# EAGLE design Isolator (EAGLE 6.4)
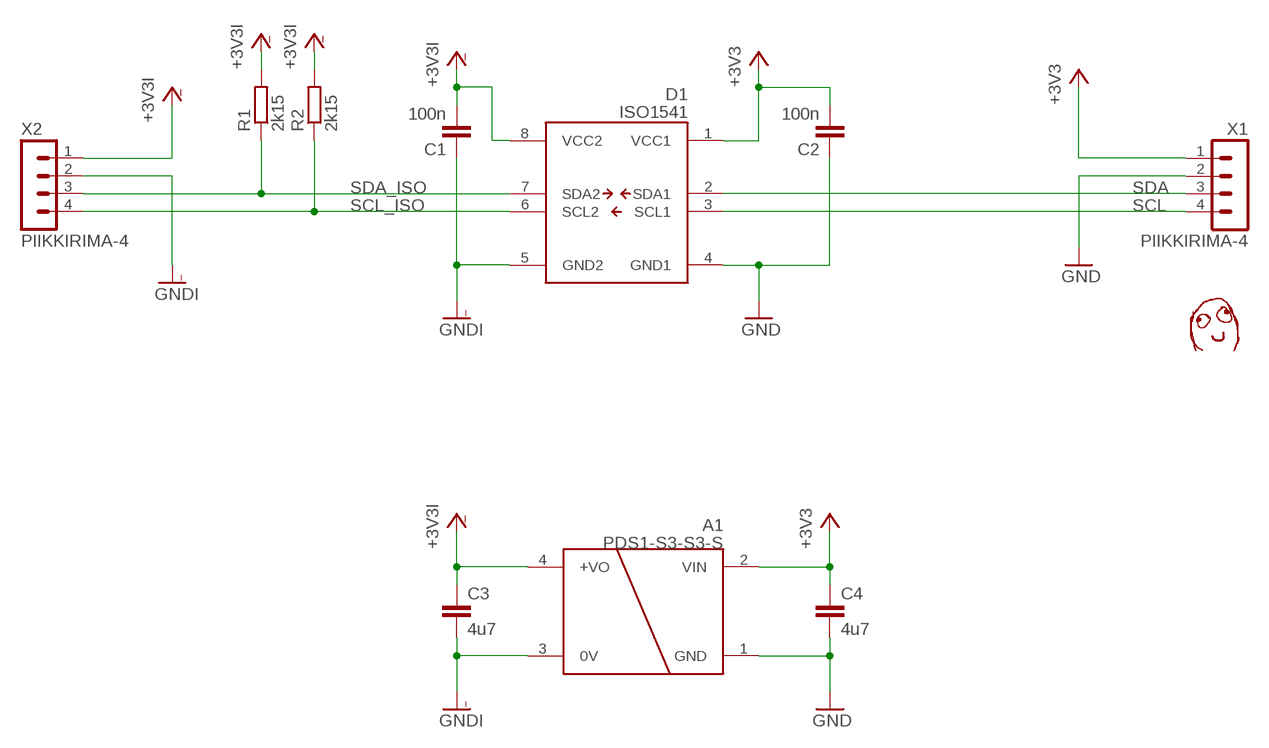
[diagram p0: schematic, sheet 1]

## Parts
A1  PDS1-S3-S3-S  [DCDC_SIP4]
C1  100n  C-EUC0603  [C0603]
C2  100n  C-EUC0603  [C0603]
C3  4u7  C-EUC0805  [C0805]
C4  4u7  C-EUC0805  [C0805]
D1  ISO1541  [SOIC8-N_MC]
R1  2k15  R-EU_R0603  [R0603]
R2  2k15  R-EU_R0603  [R0603]
U$1  DAFUG  [DAFUG]
X1  PIIKKIRIMA-4  [PIIKKIRIMA-4]
X2  PIIKKIRIMA-4  [PIIKKIRIMA-4]

## Nets
+3V3: A1.2(VIN) C2.2 C4.1 D1.1(VCC1) X1.1
+3V3I: A1.4(+VO) C1.2 C3.1 D1.8(VCC2) R1.2 R2.2 X2.1
GND: A1.1(GND) C2.1 C4.2 D1.4(GND1) X1.2
GNDI: A1.3(0V) C1.1 C3.2 D1.5(GND2) X2.2
SCL: D1.3(SCL1) X1.4
SCL_ISO: D1.6(SCL2) R2.1 X2.4
SDA: D1.2(SDA1) X1.3
SDA_ISO: D1.7(SDA2) R1.1 X2.3

## Library data of the parts
A1 = OMAT_IC:PDS1-
C1-C4 = rcl:C-EU: CAPACITOR, European symbol
D1 = OMAT_IC:ISO1541
R1 R2 = rcl:R-EU_: RESISTOR, European symbol
U$1 = dafug:DAFUG
X1 X2 = OMAT_IC:PIIKKIRIMA-4

## Board
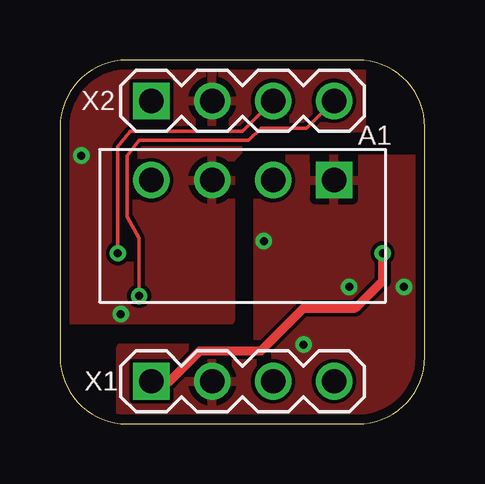
[diagram p1: board, top side]
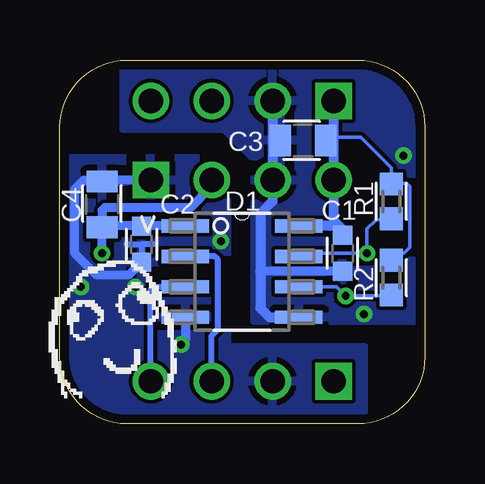
[diagram p2: board, bottom side, seen from below]

Size 15.22 x 15.16 mm. Coordinates in mm from the lower left corner, seen from the top.
Outline: 0,12.37 0,2.79 arc90 2.79,0 12.43,0 arc90 15.22,2.79 15.22,12.37 arc90 12.43,15.16 2.79,15.16 arc90 0,12.37
Copper layers (1*16): Top 0.0356mm / dielectric 1.5011mm / Bottom 0.0356mm
Design rules "LaenPCBOrder": minimum track width 6mil, minimum drill 13mil, track to track 6mil, track to pad 6mil, pad to pad 6mil, via to via 6mil, smd to smd 6mil, copper to edge 15mil, drill to drill 6mil, minimum pad ring 7mil, minimum via ring 7mil, stop-mask expansion 4mil, vias tented up to drill 0mil, thermal gap 10mil

### Footprints (pad centres in the part's own frame; a part is rotated, then mirrored left to right if it is on the bottom)
DCDC_SIP4 = drill 1.016 square: 1 0,0 | drill 1.016: 2 2.54,0; 3 5.08,0; 4 7.62,0
C0603 = smd 0.8 x 0.8: 1 -0.75,0; 2 0.75,0
C0805 = smd 0.9 x 1.3: 1 -0.95,0; 2 0.95,0
SOIC8-N_MC = smd 1.981 x 0.559: 1 -2.362,1.905; 2 -2.362,0.635; 3 -2.362,-0.635; 4 -2.362,-1.905; 5 2.362,-1.905; 6 2.362,-0.635; 7 2.362,0.635; 8 2.362,1.905
R0603 = smd 0.95 x 0.95: 1 -0.725,0; 2 0.725,0
PIIKKIRIMA-4 = drill 1.016 square: 1 0,0 | drill 1.016: 2 2.54,0; 3 5.08,0; 4 7.62,0

### Placement (x,y rotation side)
A1  11.43,10.16 180 top
C1  3.43,7.11 90 bottom
C2  11.81,7.49 90 bottom
C3  5.08,11.81 180 bottom
C4  13.46,9.14 90 bottom
D1  7.62,6.35 0 bottom
R1  1.4,9.27 90 bottom
R2  1.4,6.1 90 bottom
U$1  12.83,3.68 0 bottom
X1  3.81,1.78 0 top
X2  3.81,13.46 0 top

### Tracks (layer width: path | path; a pad name or v marks a point on that pad's centre or on a via)
+3V3  (via drill 0.33)
  Top 0.381: X1.1 4.57,1.78 5.84,3.05 8.38,3.05 10.16,4.83 12.32,4.83 13.46,5.97 v13.46,7.11
  Bottom 0.381: D1.1 11.8,8.25 C2.2 11.81,8.25 13.46,8.25 | A1.2 8.89,9.91 9.78,9.02 13.34,9.02 13.46,8.89 13.46,8.25 | 13.46,8.25 C4.1 v13.46,7.11
+3V3I
  Bottom 0.152: C3.1 4,11.94 2.67,11.94 1.4,10.67 R1.2 1.36,10.03 0.76,10.03 0.64,9.91 0.64,7.37 1.18,6.82 R2.2
  Bottom 0.381: C1.2 3.43,8.13 3.81,8.51
  Bottom 0.406: C3.1 3.81,11.81 | 3.81,11.81 A1.4 3.81,8.51 3.81,8.38 3.94,8.25 D1.8 | X2.1 3.81,11.81
GND  (via drill 0.33)
  Bottom 0.254: 11.3,7.49 11.81,7.49 | 12.45,7.49 11.81,7.49 | 11.81,7.49 11.81,6.99
  Bottom 0.381: A1.1 13.65,10.16 C4.2 13.53,10.16 14.22,10.16 14.61,9.78 14.61,7.11 13.72,6.22 12.33,6.22 C2.1 | D1.4 9.98,3.48 v10.16,3.3
  other vias: 12.06,5.71 14.35,5.71 8.51,7.62
  pour Bottom: 2.54,3.17 8.26,3.17 8.26,11.05 15.11,11.05 15.24,11.05 15.24,0 2.54,0
  pour Top: 2.54,3.17 8.26,3.17 8.26,11.05 15.24,11.05 15.24,0 2.54,0
GNDI  (via drill 0.33)
  Bottom 0.381: C1.1 6.85,6.36 6.86,6.35
  Bottom 0.406: C3.2 6.35,11.81 | 6.35,11.81 A1.3 6.35,9.27 6.86,8.76 6.86,6.35 6.86,4.83 6.48,4.45 D1.5 | X2.2 6.35,11.81
  other vias: 0.89,11.18 2.54,4.57
  pour Bottom: 12.57,15.11 12.57,12.32 8.38,12.32 7.11,11.05 7.11,4.32 0,4.32 0,15.11
  pour Top: 12.57,15.11 12.57,12.32 8.38,12.32 7.11,11.05 7.11,4.32 0,4.32 0,15.11 12.45,15.11
SCL
  Bottom 0.254: X1.4 11.43,5.59 11.3,5.71 D1.3
SCL_ISO  (via drill 0.33)
  Top 0.152: X2.4 10.29,12.32 8.38,12.32 7.87,11.81 3.3,11.81 2.79,11.18 2.79,8.64 3.3,7.75 v3.3,5.33
  Bottom 0.152: R2.1 1.43,5.33 v3.3,5.33 3.68,5.71 D1.6
SDA
  Bottom 0.254: X1.3 8.89,3.68 8.64,3.94 8.64,6.86 8.76,6.99 D1.2
SDA_ISO  (via drill 0.33)
  Top 0.152: v2.41,7.11 2.41,11.56 2.92,12.19 7.62,12.19 X2.3
  Bottom 0.152: D1.7 4.32,7.11 v2.41,7.11 2.41,8.13 2.03,8.51 1.43,8.51 R1.1